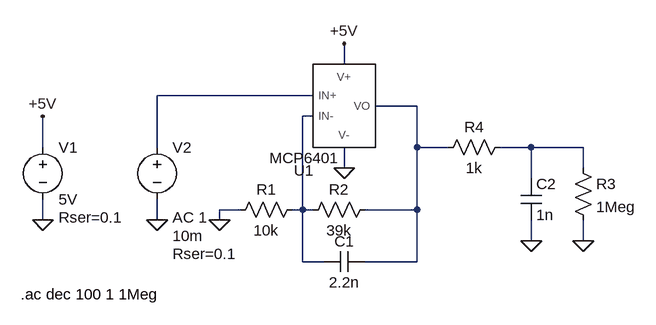
[diagram p0: schematic opamp.asc]
opamp.asc, the LTspice schematic file:
Version 4
SHEET 1 880 680
WIRE 384 48 384 16
WIRE 336 96 96 96
WIRE 496 112 432 112
WIRE 336 128 320 128
WIRE -80 176 -80 128
WIRE 96 176 96 96
WIRE 496 176 496 112
WIRE 544 176 496 176
WIRE 672 176 624 176
WIRE 752 176 672 176
WIRE 384 208 384 176
WIRE 752 208 752 176
WIRE 672 224 672 176
WIRE 224 272 192 272
WIRE 320 272 320 128
WIRE 320 272 304 272
WIRE 336 272 320 272
WIRE 496 272 496 176
WIRE 496 272 416 272
WIRE -80 288 -80 256
WIRE 96 288 96 256
WIRE 192 288 192 272
WIRE 672 320 672 288
WIRE 752 320 752 288
WIRE 320 352 320 272
WIRE 352 352 320 352
WIRE 496 352 496 272
WIRE 496 352 416 352
FLAG -80 288 0
FLAG 384 208 0
FLAG 384 16 +5V
FLAG -80 128 +5V
FLAG 192 288 0
FLAG 96 288 0
FLAG 672 320 0
FLAG 752 320 0
SYMBOL voltage -80 160 R0
WINDOW 123 0 0 Left 0
WINDOW 39 24 124 Left 2
SYMATTR InstName V1
SYMATTR Value 5V
SYMATTR SpiceLine Rser=0.1
SYMBOL MCP6401 368 128 R0
SYMATTR InstName U1
SYMBOL res 320 256 R90
WINDOW 0 0 56 VBottom 2
WINDOW 3 32 56 VTop 2
SYMATTR InstName R1
SYMATTR Value 10k
SYMBOL res 432 256 R90
WINDOW 0 0 56 VBottom 2
WINDOW 3 32 56 VTop 2
SYMATTR InstName R2
SYMATTR Value 39k
SYMBOL cap 416 336 R90
WINDOW 0 0 32 VBottom 2
WINDOW 3 32 32 VTop 2
SYMATTR InstName C1
SYMATTR Value 2.2n
SYMBOL voltage 96 160 R0
WINDOW 3 24 152 Left 2
WINDOW 123 24 124 Left 2
WINDOW 39 24 180 Left 2
SYMATTR InstName V2
SYMATTR Value 10m
SYMATTR Value2 AC 1
SYMATTR SpiceLine Rser=0.1
SYMBOL cap 656 224 R0
SYMATTR InstName C2
SYMATTR Value 1n
SYMBOL res 736 192 R0
SYMATTR InstName R3
SYMATTR Value 1Meg
SYMBOL res 640 160 R90
WINDOW 0 0 56 VBottom 2
WINDOW 3 32 56 VTop 2
SYMATTR InstName R4
SYMATTR Value 1k
TEXT -114 402 Left 2 !.ac dec 100 1 1Meg

The netlist it stands for:
* opamp.asc
V1 +5V 0 5V Rser=0.1
XU1 N001 N003 +5V 0 N002 MCP6401  ; pins IN+ IN- V+ V- VO
R1 N003 0 10k
R2 N002 N003 39k
C1 N002 N003 2.2n
V2 N001 0 10m AC 1 Rser=0.1
C2 N004 0 1n
R3 N004 0 1Meg
R4 N004 N002 1k
.ac dec 100 1 1Meg
.lib ./MCP6401.txt
.backanno
.end